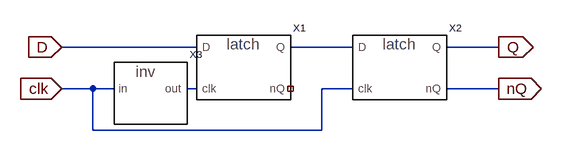
[diagram p0: schematic DFF.asc]
DFF.asc, the LTspice schematic file:
Version 4
SHEET 1 880 680
WIRE 64 112 -144 112
WIRE 304 112 208 112
WIRE 528 112 448 112
WIRE -96 176 -144 176
WIRE -64 176 -96 176
WIRE 64 176 48 176
WIRE 304 176 256 176
WIRE 528 176 448 176
WIRE -96 240 -96 176
WIRE 256 240 256 176
WIRE 256 240 -96 240
FLAG 528 112 Q
IOPIN 528 112 Out
FLAG -144 112 D
IOPIN -144 112 In
FLAG -144 176 clk
IOPIN -144 176 In
FLAG 528 176 nQ
IOPIN 528 176 Out
SYMBOL D_Latch 144 160 R0
SYMATTR InstName X1
SYMBOL D_Latch 384 160 R0
SYMATTR InstName X2
SYMBOL invert -16 192 R0
SYMATTR InstName X3

The netlist it stands for:
* DFF.asc
XX1 D N002 N001 NC_01 D_Latch  ; pins D clk Q nQ
XX2 N001 clk Q nQ D_Latch  ; pins D clk Q nQ
XX3 clk N002 invert  ; pins in out
.backanno
.end